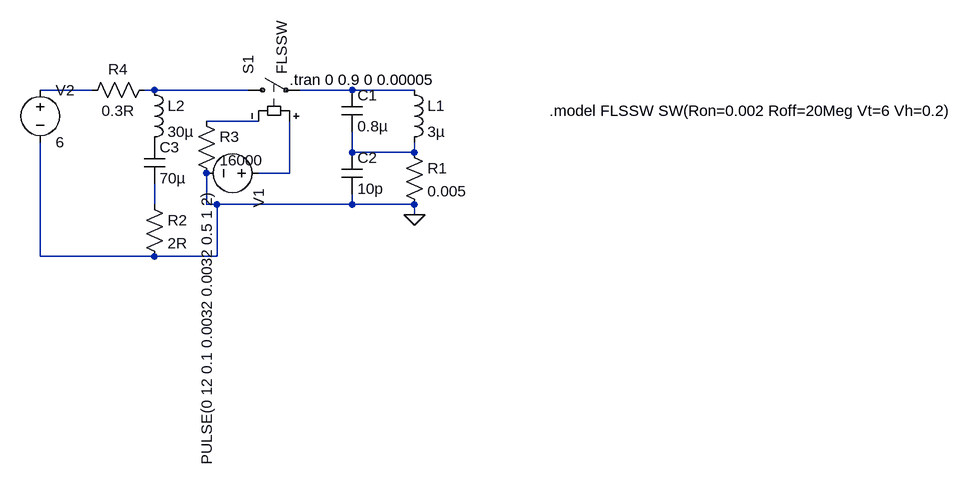
[diagram p0: schematic fls.asc]
fls.asc, the LTspice schematic file:
Version 4
SHEET 1 1056 680
WIRE -320 48 -400 48
WIRE -224 48 -240 48
WIRE -80 48 -224 48
WIRE 80 48 0 48
WIRE 176 48 80 48
WIRE -64 96 -144 96
WIRE 80 144 80 112
WIRE 176 144 176 128
WIRE 176 144 80 144
WIRE -16 176 -16 96
WIRE -16 176 -64 176
WIRE -224 224 -224 192
WIRE -144 224 -144 176
WIRE -128 224 -144 224
WIRE 80 224 80 208
WIRE 80 224 -128 224
WIRE 176 224 80 224
WIRE 176 240 176 224
WIRE -400 304 -400 128
WIRE -224 304 -400 304
WIRE -128 304 -128 224
WIRE -128 304 -224 304
FLAG 176 240 0
SYMBOL ind 160 32 R0
SYMATTR InstName L1
SYMATTR Value 3µ
SYMBOL res 160 128 R0
SYMATTR InstName R1
SYMATTR Value 0.005
SYMBOL voltage -48 176 R90
WINDOW 123 0 0 Left 0
WINDOW 39 0 0 Left 0
SYMATTR InstName V1
SYMATTR Value PULSE(0 12 0.1 0.0032 0.0032 0.5 1 2)
SYMBOL sw -96 48 R270
WINDOW 38 24 68 Left 2
SYMATTR SpiceModel FLSSW
SYMATTR InstName S1
SYMATTR Value ""
SYMBOL res -160 80 R0
SYMATTR InstName R3
SYMATTR Value 16000
SYMBOL voltage -400 32 R0
WINDOW 123 0 0 Left 0
WINDOW 39 0 0 Left 0
SYMATTR InstName V2
SYMATTR Value 6
SYMBOL res -224 32 R90
WINDOW 0 0 56 VBottom 2
WINDOW 3 32 56 VTop 2
SYMATTR InstName R4
SYMATTR Value 0.3R
SYMBOL cap 64 48 R0
SYMATTR InstName C1
SYMATTR Value 0.8µ
SYMBOL cap 64 144 R0
SYMATTR InstName C2
SYMATTR Value 10p
SYMBOL ind -240 32 R0
SYMATTR InstName L2
SYMATTR Value 30µ
SYMBOL cap -240 128 R0
SYMATTR InstName C3
SYMATTR Value 70µ
SYMBOL res -240 208 R0
SYMATTR InstName R2
SYMATTR Value 2R
TEXT -16 32 Left 2 !.tran 0 0.9 0 0.00005
TEXT 384 80 Left 2 !.model FLSSW SW(Ron=0.002 Roff=20Meg Vt=6 Vh=0.2)

The netlist it stands for:
* fls.asc
L1 N003 N005 3µ
R1 N005 0 0.005
V1 N006 0 PULSE(0 12 0.1 0.0032 0.0032 0.5 1 2)
S1 N002 N003 N006 N004 FLSSW
R3 N004 0 16000
V2 N001 0 6
R4 N002 N001 0.3R
C1 N003 N005 0.8µ
C2 N005 0 10p
L2 N002 P001 30µ
C3 P001 N007 70µ
R2 N007 0 2R
.tran 0 0.9 0 0.00005
.model FLSSW SW(Ron=0.002 Roff=20Meg Vt=6 Vh=0.2)
.backanno
.end